# Altium schematic sheet Sheet1.SchDoc
size 420 x 297 mm; ListNumber: 1
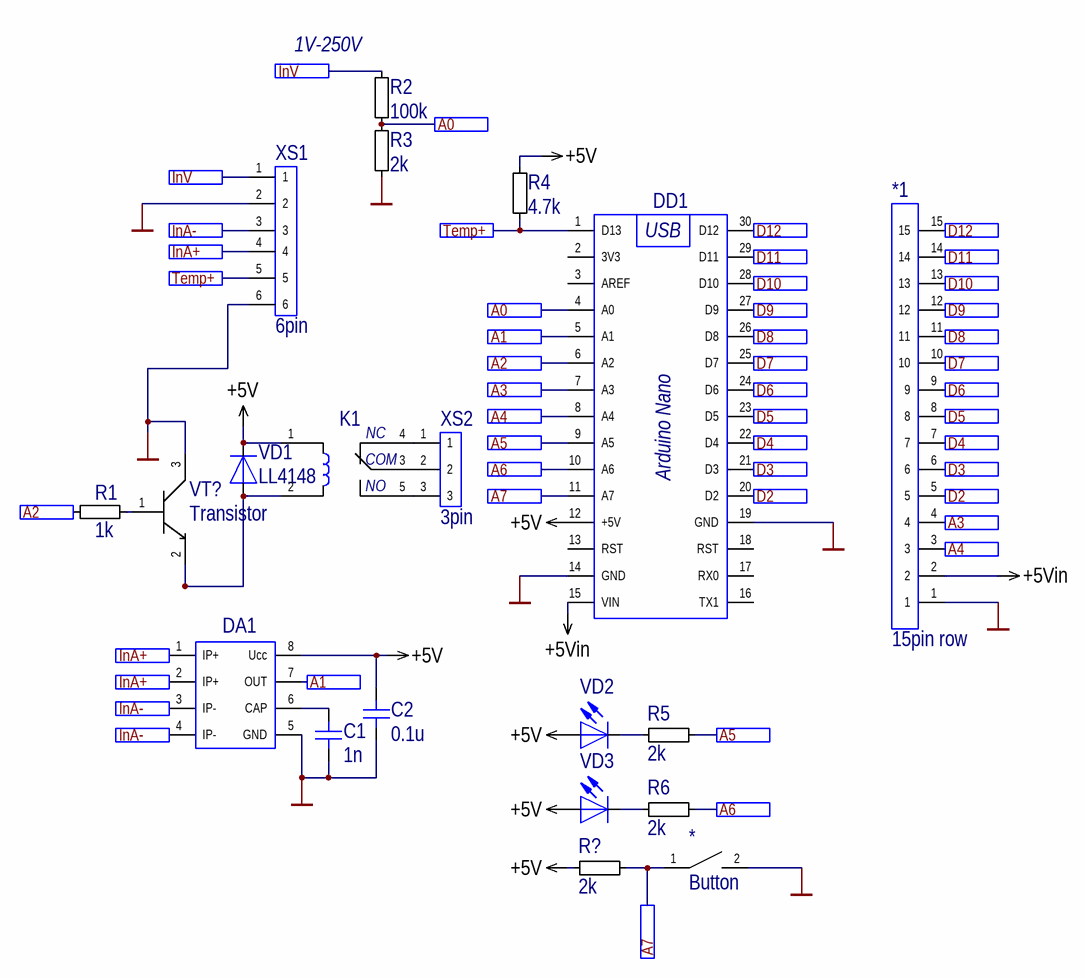
[diagram p0: Sheet1.SchDoc]

## Parts
*  Button  [SMD BUTTON STM]
*1  15pin row  [KF120-15P]
C1  value 1n  [C0603]  (hidden comment: Chip Capacitor, CL10C180JB8NNNC, 0603, 18pF ±5%, 50V, NP0, Samsung)
C2  value 0.1u  [C0603]  (hidden comment: Chip Capacitor, CL10C180JB8NNNC, 0603, 18pF ±5%, 50V, NP0, Samsung)
DA1  acs217  [SOIC-8]  (value not drawn)
DD1  Arduino nano  [Arduino Nano]  (value not drawn)
K1  Relay  [RELEY]  (value not drawn)
R1  value 1k  [R0603]  (hidden comment: Chip Resistor, RC0603FR-072KL, 0603, 2k±1%, 0,1W, Yageo)
R2  value 100k  [R0603]  (hidden comment: Chip Resistor, RC0603FR-07357RL, 0603, 357±1%, 0,1W, Yageo)
R3  value 2k  [R0603]  (hidden comment: Chip Resistor, RC0603FR-072KL, 0603, 2k±1%, 0,1W, Yageo)
R4  value 4.7k  [R0603]  (hidden comment: Chip Resistor, RC0603FR-072KL, 0603, 2k±1%, 0,1W, Yageo)
R5  value 2k  [R0603]  (hidden comment: Chip Resistor, RC0603FR-072KL, 0603, 2k±1%, 0,1W, Yageo)
R6  value 2k  [R0603]  (hidden comment: Chip Resistor, RC0603FR-072KL, 0603, 2k±1%, 0,1W, Yageo)
R?  value 2k  [R0603]  (hidden comment: Chip Resistor, RC0603FR-072KL, 0603, 2k±1%, 0,1W, Yageo)
VD1  value LL4148  [SOD-80]  (hidden comment: Diode, LL4148, SOD80, ON Semiconductor)
VD2  LED, FYL-3014YD1A, Yellow, FORYARD  [LED]  (value not drawn)
VD3  LED, FYL-3014YD1A, Yellow, FORYARD  [LED]  (value not drawn)
VT?  Transistor  [SOT-23_IT]
XS1  6pin  [6PIN]
XS2  3pin  [3pin]

## Ports
A0, A1, A2, A3, A4, A5, A6, A7, D2, D3, D4, D5, D6, D7, D8, D9, D10, D11, D12, InA+, InA-, InV, Temp+

## Nets
+5V: C2.2 DA1.8(Ucc) DD1.12(+5V) K1.1 R4.2 R?.2 VD1.1(K) VD2.2(A) VD3.2(A)
+5Vin: *1.2 DD1.15(VIN)
GND: *.2 *1.1 C1.1 C2.1 DA1.5(GND) DD1.14(GND) DD1.19(GND) R3.1 VT?.3 XS1.2 XS1.6
A0: DD1.4(A0) R2.1 R3.2 ; port A0
A1: DA1.7(OUT) DD1.5(A1) ; port A1
A2: DD1.6(A2) R1.2 ; port A2
A3: *1.4 DD1.7(A3) ; port A3
A4: *1.3 DD1.8(A4) ; port A4
A5: DD1.9(A5) R5.1 ; port A5
A6: DD1.10(A6) R6.1 ; port A6
A7: *.1 DD1.11(A7) R?.1 ; port A7
D2: *1.5 DD1.20(D2) ; port D2
D3: *1.6 DD1.21(D3) ; port D3
D4: *1.7 DD1.22(D4) ; port D4
D5: *1.8 DD1.23(D5) ; port D5
D6: *1.9 DD1.24(D6) ; port D6
D7: *1.10 DD1.25(D7) ; port D7
D8: *1.11 DD1.26(D8) ; port D8
D9: *1.12 DD1.27(D9) ; port D9
D10: *1.13 DD1.28(D10) ; port D10
D11: *1.14 DD1.29(D11) ; port D11
D12: *1.15 DD1.30(D12) ; port D12
InA+: DA1.1(IP+) DA1.2(IP+) XS1.4 ; port InA+
InA-: DA1.3(IP-) DA1.4(IP-) XS1.3 ; port InA-
InV: R2.2 XS1.1 ; port InV
Temp+: DD1.1(D13) R4.1 XS1.5 ; port Temp+
NetC1_2: C1.2 DA1.6(CAP)
NetK1_2: K1.2 VD1.2(A) VT?.2
NetK1_3: K1.3 XS2.2
NetK1_4: K1.4 XS2.1
NetK1_5: K1.5 XS2.3
NetR1_1: R1.1 VT?.1
NetR5_2: R5.2 VD2.1(K)
NetR6_2: R6.2 VD3.1(K)

Not connected (* = marked no-connect by the designer): DD1 2(3V3) 3(AREF) 13(RST) 16(TX1) 17(RX0) 18(RST)

## Notes on the sheet
- (near R2) 1V-250V
- Перв. примен.
- Справ. №
- Подп. и дата
- Инв. № дубл.
- Взам. инв. №
- Изм.
- Лист
- № докум.
- Подп.
- Дата
- Лит.
- Масса
- Масштаб
- Разраб.
- Пров.
- Т. контр.
- Листов
- Инв. № подл.
- Н. контр.
- Утв.
- Копировал
- Формат А3
- (in symbol Arduino nano) USB; Arduino Nano
- (in symbol Relay) NC; COM; NO

## Library data of the parts
C1 C2 = 68: idComponent: 68; Jofre_PN: CK840; Component_Group: Capacitors; Mounting_Type: SMD; Operating_Temperature: -55°C...+ 125°C; Notes: price Digi-Key @ 4000; User: Busliuk@localhost; Component_Type: Capacitors; Package: 0603; Manufacturer: Samsung; Manufacturer_PN: CL10C180JB8NNNC; ComponentLink1Description: Datasheet; ComponentLink1URL: http://www.samsungsem.com/kr/support/product-search/mlcc/__icsFiles/afieldfile/2016/08/18/S_CL10C180JB8NNNC.pdf; Price_EUR: 0,00493; Status: Unchecked; Date_of_Update: 09.10.2018 12:17:55; Date_of_Creation: 17.03.2018 10:18:18
R1 R3-R6 R? = 886: Chip Resistor, RC0603FR-072KL, 0603, 2k±1%, 0,1W, ±100ppm/°C, -55°C ~ 155°C, Yageo; idComponent: 886; Jofre_PN: **; Component_Group: Resistors; Mounting_Type: SMD; Marking_Code: 30B; Operating_Temperature: -55°C...+ 155°C; Notes: price Digi-Key 5.000; User: Busliuk@localhost; Component_Type: Resistors; Package: 0603; Manufacturer: Yageo; Manufacturer_PN: RC0603FR-072KL; ComponentLink1Description: Datasheet; ComponentLink1URL: http://www.yageo.com/documents/recent/PYu-RC_Group_51_RoHS_L_9.pdf; Price_EUR: 0,00164; Status: Unchecked; Date_of_Update: 09.10.2018 12:19:01; Date_of_Creation: 11.06.2018 9:24:28
R2 = 390: Chip Resistor, RC0603FR-07357RL, 0603, 357±1%, 0,1W, ±100ppm/°C, -55°C ~ 155°C, Yageo; idComponent: 390; Jofre_PN: **; Component_Group: Resistors; Mounting_Type: SMD; Marking_Code: 54A; Operating_Temperature: -55°C...+ 155°C; Notes: price Digi-Key 5.000; User: Busliuk@localhost; Component_Type: Resistors; Package: 0603; Manufacturer: Yageo; Manufacturer_PN: RC0603FR-07357RL; ComponentLink1Description: Datasheet; ComponentLink1URL: http://www.yageo.com/documents/recent/PYu-RC_Group_51_RoHS_L_9.pdf; Price_EUR: 0,00158; Status: Unchecked; Date_of_Update: 09.10.2018 12:19:01; Date_of_Creation: 02.05.2018 15:22:41
VD1 = 4192: Diode, LL4148, 100V, 200mA, SOD80, -55°C...+175°C, ON Semiconductor; idComponent: 4192; Jofre_PN: VD040; Component_Group: Diodes; Mounting_Type: SMD; Notes: price Digi-Key 2.500; User: ke-sta@kd-sta; Component_Type: Diodes; Package: SOD80; Marking_Code: -; Operating_Temperature: -55°C...+175°C; Manufacturer: ON Semiconductor; Manufacturer_PN: LL4148; ComponentLink1Description: Datasheet; ComponentLink1URL: https://www.fairchildsemi.com/datasheets/LL/LL4148.pdf; Price_EUR: 0,01569; Status: Unchecked; Date_of_Update: 30.11.2018 12:52:03; Date_of_Creation: 12.11.2018 10:19:05
VD2 VD3 = 4165: LED, FYL-3014YD1A, Yellow, 585~595nm, 40mcd, 40 deg, 1.8~2.6V, 20 mA, -40°C...+85°C, FORYARD; idComponent: 4165; Jofre_PN: HL013; Component_Group: Diodes; Mounting_Type: THT; Notes: price TME @1000; User: ke-sta@kd-sta; Value: FYL-3014YD1A; Component_Type: LED; Package: 3mm; Marking_Code: -; Operating_Temperature: -40°C...+85°C; Manufacturer: FORYARD; Manufacturer_PN: FYL-3014YD1A; ComponentLink1Description: Datasheet; ComponentLink1URL: https://www.tme.eu/en/Document/c9e11d3e1bd46805dfdc426bee57145d/FYL-3014YD1A.pdf; Price_EUR: 0,021; Status: Unchecked; Date_of_Update: 12.11.2018 13:08:34; Date_of_Creation: 30.10.2018 18:40:31